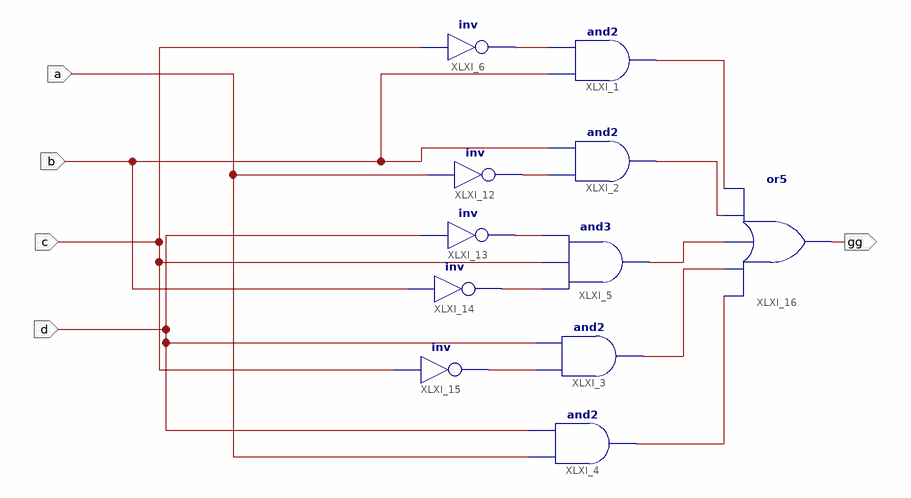
[diagram p0: schematic sheet 1]
// Xilinx ISE schematic hexG.sch (spartan6) as structural Verilog: 11 symbols, 5 ports
module hexG (
  input  a,
  input  b,
  input  c,
  input  d,
  output gg
);

  wire XLXN_6, XLXN_7, XLXN_8, XLXN_9, XLXN_10, XLXN_20, XLXN_21, XLXN_23, XLXN_24, XLXN_25;

  and XLXI_1 (XLXN_20, b, XLXN_7);
  and XLXI_2 (XLXN_21, XLXN_6, b);
  and XLXI_3 (XLXN_24, XLXN_10, d);
  and XLXI_4 (XLXN_25, a, d);
  and XLXI_5 (XLXN_23, XLXN_9, c, XLXN_8);
  not XLXI_6 (XLXN_7, c);
  not XLXI_12 (XLXN_6, a);
  not XLXI_13 (XLXN_8, d);
  not XLXI_14 (XLXN_9, b);
  not XLXI_15 (XLXN_10, c);
  or XLXI_16 (gg, XLXN_25, XLXN_24, XLXN_23, XLXN_21, XLXN_20);
endmodule
